# Altium schematic sheet [7] - MIO0, MIO1, SD, USB.SchDoc: MIO0, MIO1, SD CARD, USB-OTG
size B; Organization: Altium Limited; Address1: L3, 12a Rodborough Rd; Address2: Frenchs Forest; Address3: NSW; Address4: Australia 2086; DocumentNumber: 7; Revision: V1I1; SheetNumber: 7; SheetTotal: 16
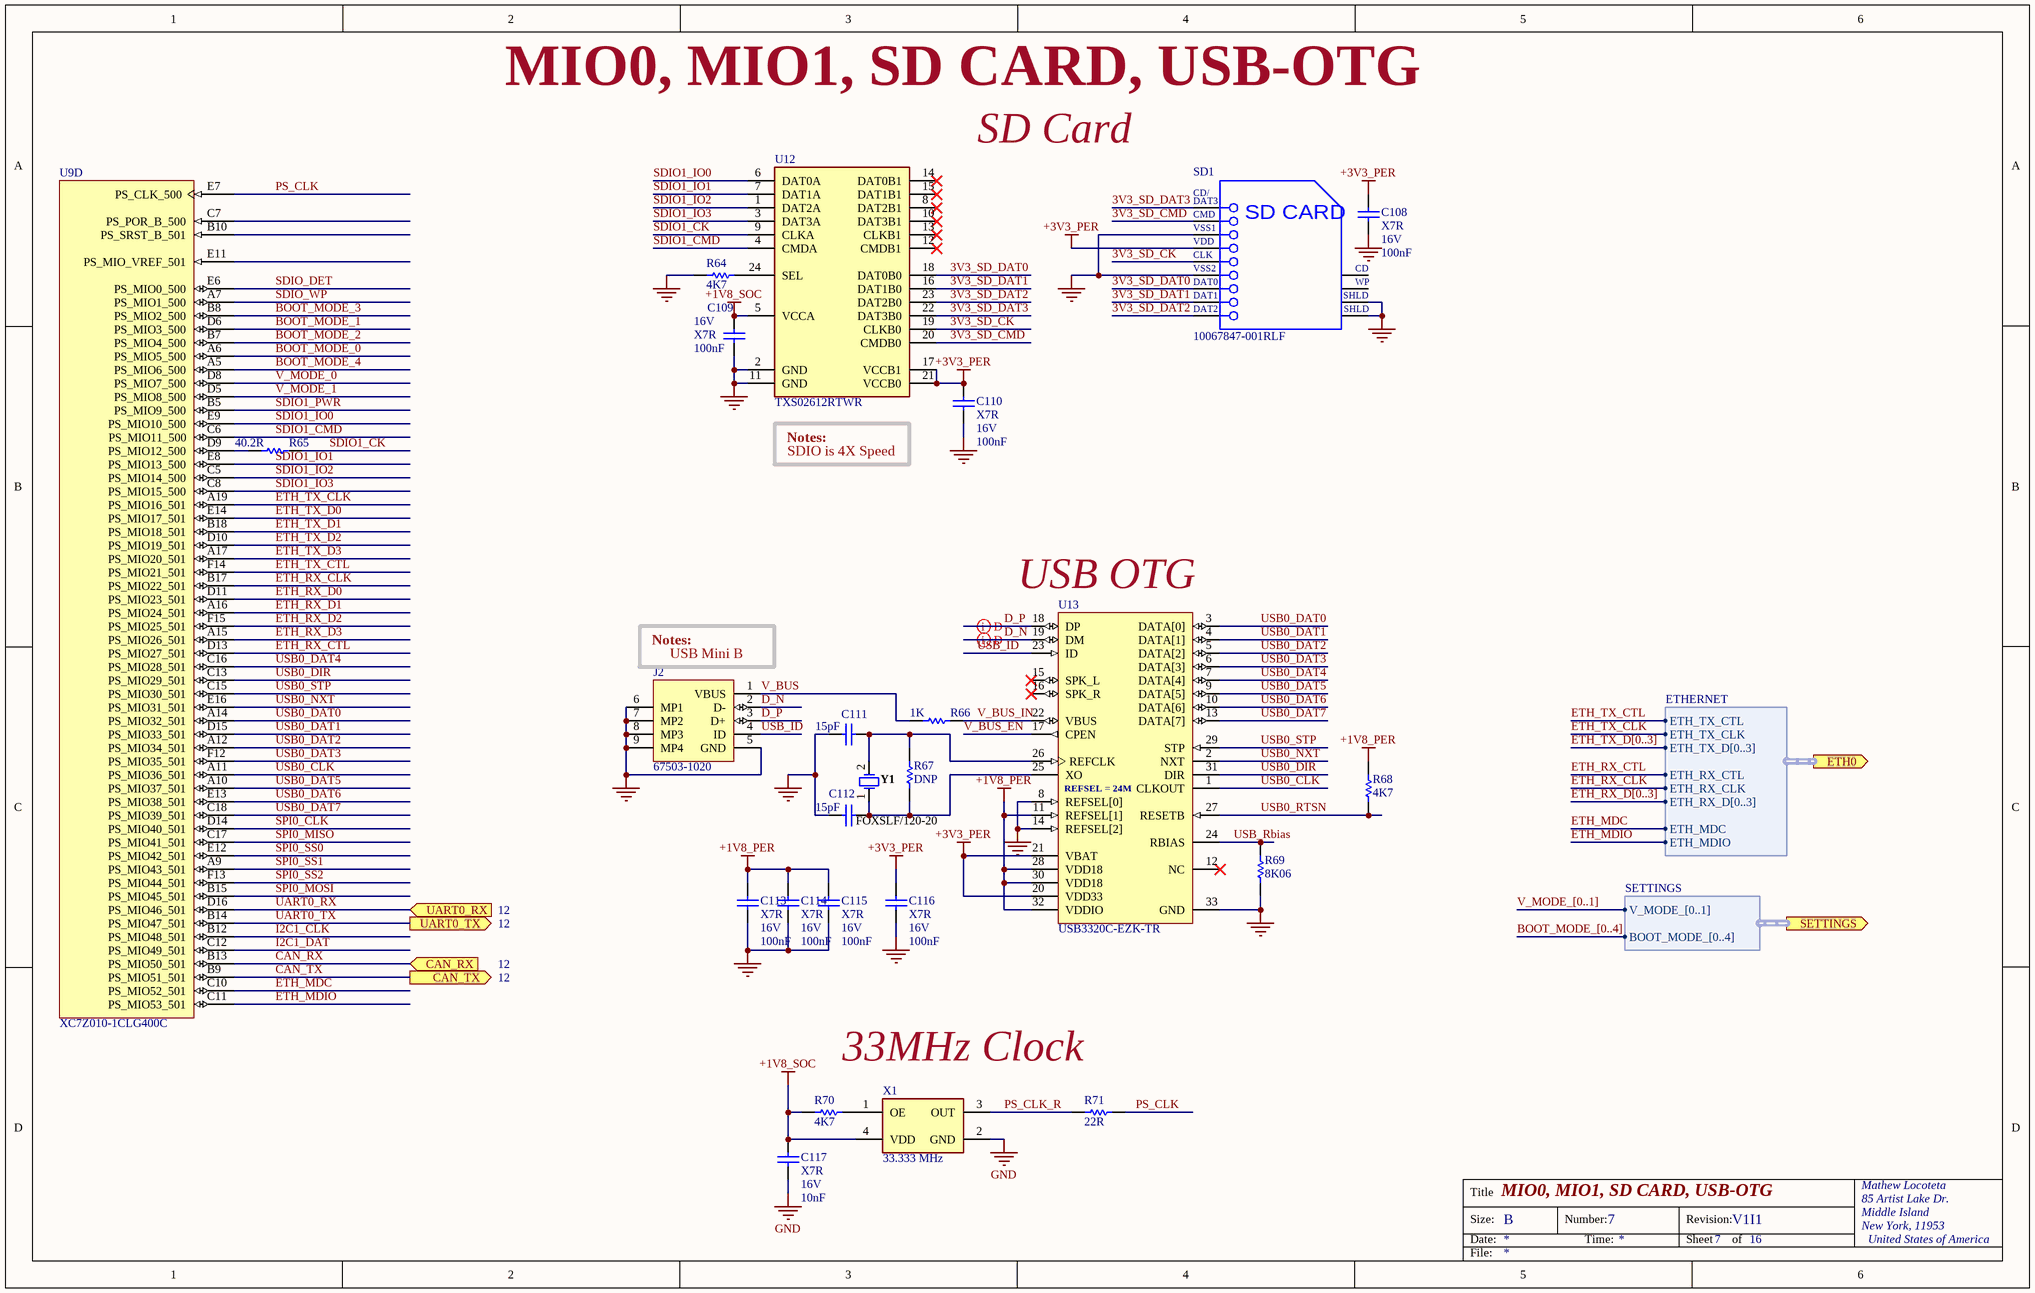
[diagram p0: [7] - MIO0, MIO1, SD, USB.SchDoc]

## Parts
C108  Dielectric: X7R  Voltage Rating: 16V  Capacitance: 100nF  (hidden comment: 100nF 0402 16V)
C109  Dielectric: X7R  Voltage Rating: 16V  Capacitance: 100nF  (hidden comment: 100nF 0402 16V)
C110  Dielectric: X7R  Voltage Rating: 16V  Capacitance: 100nF  (hidden comment: 100nF 0402 16V)
C111  Capacitance: 15pF  (hidden comment: 15 pF 50V C0G)
C112  Capacitance: 15pF  (hidden comment: 15 pF 50V C0G)
C113  Dielectric: X7R  Voltage Rating: 16V  Capacitance: 100nF  (hidden comment: 100nF 0402 16V)
C114  Dielectric: X7R  Voltage Rating: 16V  Capacitance: 100nF  (hidden comment: 100nF 0402 16V)
C115  Dielectric: X7R  Voltage Rating: 16V  Capacitance: 100nF  (hidden comment: 100nF 0402 16V)
C116  Dielectric: X7R  Voltage Rating: 16V  Capacitance: 100nF  (hidden comment: 100nF 0402 16V)
C117  Dielectric: X7R  Voltage Rating: 16V  Capacitance: 10nF  (hidden comment: 10nF 16V 0402 X7R)
J2  67503-1020  [MOLX-67503-1020_V]
R64  Resistance: 4K7  (hidden comment: 4K7 0402 1%)
R65  Resistance: 40.2R  (hidden comment: 40R2 1% 0402)
R66  Resistance: 1K  (hidden comment: 1K 1/8W 0402 1%)
R67  DNP  (no BOM)
R68  Resistance: 4K7  (hidden comment: 4K7 0402 1%)
R69  Resistance: 8K06  (hidden comment: 8K06 0402 1%)
R70  Resistance: 4K7  (hidden comment: 4K7 0402 1%)
R71  Resistance: 22R  (hidden comment: 22R 0402 1%)
SD1  10067847-001RLF  [FCI-10067847-001RLF_V]
U9  XC7Z010-1CLG400C  [CLG400]  (part D of 9)
U12  TXS02612RTWR
U13  USB3320C-EZK-TR  [MCHP-QFN-32-5x5_V2]
X1  33.333 MHz
Y1  FOXSLF/120-20  [FOX-FOXSLF-2_V]

## Ports
CAN_RX (in), CAN_TX (out), ETH0 (out, harness ETHERNET), SETTINGS (out, harness SETTINGS), UART0_RX (in), UART0_TX (out)

## Harnesses
SETTINGS: BOOT_MODE_[0..4], V_MODE_[0..1]
ETHERNET: ETH_TX_D[0..3], ETH_RX_D[0..3], ETH_RX_CLK, ETH_TX_CLK, ETH_TX_CTL, ETH_RX_CTL, ETH_MDC, ETH_MDIO

## Nets
+1V8_PER: C113.2 C114.2 C115.2 R68.2 U13.11(REFSEL[1]) U13.28(VDD18) U13.30(VDD18) U13.32(VDDIO)
+1V8_SOC: C109.2 C117.2 R70.1 U12.5(VCCA) X1.4(VDD)
+3V3_PER: C108.1 C110.1 C116.2 SD1.4(VDD) U12.17(VCCB1) U12.21(VCCB0) U13.20(VDD33) U13.21(VBAT)
GND: C108.2 C109.1 C110.2 C111.2 C112.1 C113.1 C114.1 C115.1 C116.1 C117.1 J2.5(GND) J2.6(MP1) J2.7(MP2) J2.8(MP3) J2.9(MP4) R64.1 R69.1 SD1.3(VSS1) SD1.6(VSS2) SD1.12(SHLD1) SD1.13(SHLD2) U12.2(GND) U12.11(GND) U13.8(REFSEL[0]) U13.14(REFSEL[2]) U13.33(GND) X1.2(GND)
3V3_SD_CK: SD1.5(CLK) U12.19(CLKB0)
3V3_SD_CMD: SD1.2(CMD) U12.20(CMDB0)
3V3_SD_DAT0: SD1.7(DAT0) U12.18(DAT0B0)
3V3_SD_DAT1: SD1.8(DAT1) U12.16(DAT1B0)
3V3_SD_DAT2: SD1.9(DAT2) U12.23(DAT2B0)
3V3_SD_DAT3: SD1.1(CD/DAT3) U12.22(DAT3B0)
BOOT_MODE_0: U9.A6(PS_MIO5_500)
BOOT_MODE_1: U9.D6(PS_MIO3_500)
BOOT_MODE_2: U9.B7(PS_MIO4_500)
BOOT_MODE_3: U9.B8(PS_MIO2_500)
BOOT_MODE_4: U9.A5(PS_MIO6_500)
CAN_RX: U9.B13(PS_MIO50_501) ; port CAN_RX
CAN_TX: U9.B9(PS_MIO51_501) ; port CAN_TX
D_N: J2.2(D-) U13.19(DM)
D_P: J2.3(D+) U13.18(DP)
ETH_MDC: U9.C10(PS_MIO52_501) ; port ETH0.ETH_MDC
ETH_MDIO: U9.C11(PS_MIO53_501) ; port ETH0.ETH_MDIO
ETH_RX_CLK: U9.B17(PS_MIO22_501) ; port ETH0.ETH_RX_CLK
ETH_RX_CTL: U9.D13(PS_MIO27_501) ; port ETH0.ETH_RX_CTL
ETH_RX_D0: U9.D11(PS_MIO23_501)
ETH_RX_D1: U9.A16(PS_MIO24_501)
ETH_RX_D2: U9.F15(PS_MIO25_501)
ETH_RX_D3: U9.A15(PS_MIO26_501)
ETH_TX_CLK: U9.A19(PS_MIO16_501) ; port ETH0.ETH_TX_CLK
ETH_TX_CTL: U9.F14(PS_MIO21_501) ; port ETH0.ETH_TX_CTL
ETH_TX_D0: U9.E14(PS_MIO17_501)
ETH_TX_D1: U9.B18(PS_MIO18_501)
ETH_TX_D2: U9.D10(PS_MIO19_501)
ETH_TX_D3: U9.A17(PS_MIO20_501)
I2C1_CLK: U9.B12(PS_MIO48_501)
I2C1_DAT: U9.C12(PS_MIO49_501)
PS_CLK: R71.2 U9.E7(PS_CLK_500)
PS_CLK_R: R71.1 X1.3(OUT)
SDIO1_CK: R65.2 U12.9(CLKA)
SDIO1_CMD: U9.C6(PS_MIO11_500) U12.4(CMDA)
SDIO1_IO0: U9.E9(PS_MIO10_500) U12.6(DAT0A)
SDIO1_IO1: U9.E8(PS_MIO13_500) U12.7(DAT1A)
SDIO1_IO2: U9.C5(PS_MIO14_500) U12.1(DAT2A)
SDIO1_IO3: U9.C8(PS_MIO15_500) U12.3(DAT3A)
SDIO1_PWR: U9.B5(PS_MIO9_500)
SDIO_DET: U9.E6(PS_MIO0_500)
SDIO_WP: U9.A7(PS_MIO1_500)
SPI0_CLK: U9.D14(PS_MIO40_501)
SPI0_MISO: U9.C17(PS_MIO41_501)
SPI0_MOSI: U9.B15(PS_MIO45_501)
SPI0_SS0: U9.E12(PS_MIO42_501)
SPI0_SS1: U9.A9(PS_MIO43_501)
SPI0_SS2: U9.F13(PS_MIO44_501)
UART0_RX: U9.D16(PS_MIO46_501) ; port UART0_RX
UART0_TX: U9.B14(PS_MIO47_501) ; port UART0_TX
USB0_CLK: U9.A11(PS_MIO36_501) U13.1(CLKOUT)
USB0_DAT0: U9.A14(PS_MIO32_501) U13.3(DATA[0])
USB0_DAT1: U9.D15(PS_MIO33_501) U13.4(DATA[1])
USB0_DAT2: U9.A12(PS_MIO34_501) U13.5(DATA[2])
USB0_DAT3: U9.F12(PS_MIO35_501) U13.6(DATA[3])
USB0_DAT4: U9.C16(PS_MIO28_501) U13.7(DATA[4])
USB0_DAT5: U9.A10(PS_MIO37_501) U13.9(DATA[5])
USB0_DAT6: U9.E13(PS_MIO38_501) U13.10(DATA[6])
USB0_DAT7: U9.C18(PS_MIO39_501) U13.13(DATA[7])
USB0_DIR: U9.C13(PS_MIO29_501) U13.31(DIR)
USB0_NXT: U9.E16(PS_MIO31_501) U13.2(NXT)
USB0_RTSN: R68.1 U13.27(RESETB)
USB0_STP: U9.C15(PS_MIO30_501) U13.29(STP)
USB_ID: J2.4(ID) U13.23(ID)
USB_Rbias: R69.2 U13.24(RBIAS)
V_BUS: J2.1(VBUS) R66.1
V_BUS_EN: U13.17(CPEN)
V_BUS_IN: R66.2 U13.22(VBUS)
V_MODE_0: U9.D8(PS_MIO7_500)
V_MODE_1: U9.D5(PS_MIO8_500)
NetC111_1: C111.1 R67.2 U13.26(REFCLK) Y1.2
NetC112_2: C112.2 R67.1 U13.25(XO) Y1.1
NetR64_2: R64.2 U12.24(SEL)
NetR65_1: R65.1 U9.D9(PS_MIO12_500)
NetR70_2: R70.2 X1.1(OE)

Not connected (* = marked no-connect by the designer): SD1 10(CD) 11(WP); U9 B10(PS_SRST_B_501) C7(PS_POR_B_500) E11(PS_MIO_VREF_501); U12 8(DAT2B1)* 10(DAT3B1)* 12(CMDB1)* 13(CLKB1)* 14(DAT0B1)* 15(DAT1B1)*; U13 12(NC)* 15(SPK_L)* 16(SPK_R)*

## Buses and harness runs
bus BOOT_MODE_[0..4]
bus ETH_RX_D[0..3]
bus ETH_TX_D[0..3]
bus V_MODE_[0..1]

## Layout directives
differential pair: D_N, D_P

## Notes on the sheet
- MIO0, MIO1, SD CARD, USB-OTG
- SD Card
- (near U12) Notes:
- SDIO is 4X Speed
- (near J2) Notes:
- (near U13) USB OTG
- (near J2) USB Mini B
- (near U13) REFSEL = 24M
- 12
- 33MHz Clock
- Title
- Size:
- Date:
- B
- Number:
- Time:
- Revision:
- Sheet
- of
- Mathew Locoteta
- 85 Artist Lake Dr.
- Middle Island
- New York, 11953
- United States of America
- File:
- (in symbol CMP-2000-05818-1) CD/; DAT3; SD CARD; SHLD

## Library data of the parts
C108-C110 C113-C116 = C0402C104J4RACTU: KEMET - C0402C104J4RACTU - SMD Multilayer Ceramic Capacitor, 0.1 µF, 16 V, 0402 [1005 Metric], ± 5%, X7R, C Series KEMET; Dissipation Factor: 3.5%; Supplier 1: Digi-Key; Manufacturer: KEMET; Manufacturer Part Number: C0402C104J4RACTU; RoHS: Yes; Category: Ceramic Capacitors; Stock 1: 106350; Pricing 1: 1=0.48000, 10=0.33900, 50=0.25620, 100=0.22310, 500=0.16528, 1000=0.14049, 2500=0.13223, 5000=0.12396 (USD); Mount: Surface Mount,PCB; Case/Package: 0402; Case Code (Metric): 1005; Case Code (Imperial): 0402; Dielectric Material: Ceramic; Contact Plating: Tin,Matte; Min Operating Temperature: -55°C; Max Operating Temperature: 125°C; Tolerance: 5%; Packaging: Tape and Reel; Package Quantity: 1; Termination: SMD/SMT; Voltage: 16V; Length: 1mm; Height: 0.5mm; Width: 0.02inch; Thickness: 0.022inch; Depth: 0.5mm; Radiation Hardening: No; REACH SVHC: No SVHC; ComponentLink1URL: https://datasheet.ciiva.com/5415/kem-c1002-x7r-smd-5415819.pdf?src-supplier=Mouser; ComponentLink1Description: https://datasheet.ciiva.com/5415/kem-c1002-x7r-smd-5415819.pdf?src-supplier=Mouser; ComponentLink2URL: https://datasheet.ciiva.com/46424/1851736-46424159.pdf?src-supplier=Element14; ComponentLink2Description: https://datasheet.ciiva.com/46424/1851736-46424159.pdf?src-supplier=Element14; Supplier Part Number 1: 399-7761-1-ND; Voltage Rating (DC): 16V
C111 C112 = CGA2B2C0G1H150J050BA: CAP CER 15PF 50V C0G 0402; Manufacturer: TDK; Tolerance: 5%; Supplier 1: Digi-Key; Manufacturer Part Number: CGA2B2C0G1H150J050BA; RoHS: Yes; Category: Ceramic Capacitors; Stock 1: 21961; Pricing 1: 1=0.10000, 10=0.05700, 50=0.03120, 100=0.02550, 500=0.01820, 1000=0.01429, 2500=0.01299, 5000=0.01195 (USD); Mount: Surface Mount; Case/Package: 0402; Weight: 2.3E-05oz; Case Code (Metric): 1005; Case Code (Imperial): 0402; Min Operating Temperature: -55°C; Max Operating Temperature: 125°C; Packaging: Tape and Reel; Package Quantity: 1; Voltage Rating (DC): 50V; Termination: SMD/SMT; Composition: Ceramic; Length: 1mm; Height: 0.5mm; Width: 0.02inch; Thickness: 0.022inch; Depth: 0.5mm; Ratings: AEC-Q200; Lead Free: Lead Free; REACH SVHC: No SVHC; ComponentLink1URL: https://datasheet.ciiva.com/24216/cga2b2c0g1h150j050ba-266199-24216926.pdf?src-supplier=Mouser; ComponentLink1Description: https://datasheet.ciiva.com/24216/cga2b2c0g1h150j050ba-266199-24216926.pdf?src-supplier=Mouser; Supplier Part Number 1: 445-5586-1-ND; Dielectric: C0G; Voltage Rating: 50V
C117 = C0402C103J4RACTU: KEMET - C0402C103J4RACTU - SMD Multilayer Ceramic Capacitor, 10000 pF, 16 V, 0402 [1005 Metric], ± 5%, X7R, C Series KEMET; Dissipation Factor: 3.5%; Supplier 1: Digi-Key; Manufacturer: KEMET; Manufacturer Part Number: C0402C103J4RACTU; RoHS: Yes; Category: Ceramic Capacitors; Stock 1: 814650; Pricing 1: 1=0.53000, 10=0.37100, 50=0.25960, 100=0.22250, 500=0.16688, 1000=0.14093, 2500=0.13351, 5000=0.12609 (USD); Mount: Surface Mount,PCB; Case/Package: 0402; Number of Pins: 2; Case Code (Metric): 1005; Case Code (Imperial): 0402; Dielectric Material: Ceramic; Min Operating Temperature: -55°C; Max Operating Temperature: 125°C; Packaging: Tape and Reel; Tolerance: 5%; Package Quantity: 10000; Voltage Rating (DC): 16V; Termination: SMD/SMT; Voltage: 16V; Length: 1mm; Height: 0.5mm; Width: 0.02inch; Thickness: 0.022inch; Depth: 0.5mm; Radiation Hardening: No; REACH SVHC: No SVHC; ComponentLink1URL: https://datasheet.ciiva.com/46448/1851736-46448647.pdf?src-supplier=Element14; ComponentLink1Description: https://datasheet.ciiva.com/46448/1851736-46448647.pdf?src-supplier=Element14; ComponentLink2URL: https://datasheet.ciiva.com/14593/70095383-14593069.pdf?src-supplier=Allied+Electronics; ComponentLink2Description: https://datasheet.ciiva.com/14593/70095383-14593069.pdf?src-supplier=Allied+Electronics; ComponentLink3URL: https://datasheet.ciiva.com/7747/kem-c1002-x7r-smd-7747611.pdf?src-supplier=Element14; ComponentLink3Description: https://datasheet.ciiva.com/7747/kem-c1002-x7r-smd-7747611.pdf?src-supplier=Element14; ComponentLink4URL: https://datasheet.ciiva.com/14604/70095383-14604557.pdf?src-supplier=Allied+Electronics; ComponentLink4Description: https://datasheet.ciiva.com/14604/70095383-14604557.pdf?src-supplier=Allied+Electronics; ComponentLink5URL: https://datasheet.ciiva.com/28645/1851736-28645374.pdf?src-supplier=Element14; ComponentLink5Description: https://datasheet.ciiva.com/28645/1851736-28645374.pdf?src-supplier=Element14; Supplier Part Number 1: 399-1039-1-ND
J2 = CMP-0411-00002-1: USB, MINI, SMD, RA KME04-USBMU03A01; Manufacturer: Molex; ComponentLink1URL: http://www.molex.com/; PartNumber: 67503-1020; Mounting Technology: Surface Mount; ComponentLink1Description: Manufacturer URL; Terminal Pitch: 0.8 mm; DatasheetVersion: Rev F, 06/2009; ComponentLink2Description: Datasheet; PackageDescription: Mini USB Connector, SMT, Righer Angle; ComponentLink2URL: http://www.molex.com/pdm_docs/sd/675031020_sd.pdf; PackageReference: 67503-1020
R64 R68 R70 = CRCW04024K70FKED: Resistor SMD 4.7 kOhm 0402 PU=10000 ST, CRCW04024K70FKED, Vishay; Power Rating: 63mW; Temperature Coefficient: 100ppm/°C; Voltage Rating: 50V; Supplier 1: Digi-Key; Manufacturer: Vishay; Manufacturer Part Number: CRCW04024K70FKED; RoHS: Yes; Category: Chip SMD Resistors; Stock 1: 575743; Pricing 1: 1=0.10000, 10=0.03500, 100=0.01410, 1000=0.00633, 2500=0.00550, 5000=0.00454 (USD); Mount: Surface Mount; Case/Package: 0402; Weight: 2.3E-05oz; Contact Plating: Tin; Case Code (Imperial): 0402; Case Code (Metric): 1005; Min Operating Temperature: -55°C; Max Operating Temperature: 155°C; Tolerance: 1%; Composition: Thick Film; Packaging: Tape and Reel; Package Quantity: 10; Termination: SMD/SMT; Military Standard: Not; Voltage Rating (DC): 50V; Number of Terminations: 2; Max Power Dissipation: 63mW; Features: Automotive AEC-Q200; Length: 1mm; Height: 0.35mm; Width: 0.5mm; Depth: 0.5mm; Radiation Hardening: No; Lead Free: Lead Free; REACH SVHC: Unknown; ComponentLink1URL: https://datasheet.ciiva.com/11808/0900766b80d98824-11808622.pdf?src-supplier=RSComponents; ComponentLink1Description: https://datasheet.ciiva.com/11808/0900766b80d98824-11808622.pdf?src-supplier=RSComponents; ComponentLink2URL: https://datasheet.ciiva.com/3256/dcrcwe3-3256597.pdf?src-supplier=Avnet; ComponentLink2Description: https://datasheet.ciiva.com/3256/dcrcwe3-3256597.pdf?src-supplier=Avnet; ComponentLink3URL: https://datasheet.ciiva.com/5550/dcrcwe3-109170-5550295.pdf?src-supplier=Mouser; ComponentLink3Description: https://datasheet.ciiva.com/5550/dcrcwe3-109170-5550295.pdf?src-supplier=Mouser; ComponentLink4URL: https://datasheet.ciiva.com/16764/70201119-16764281.pdf?src-supplier=Allied+Electronics; ComponentLink4Description: https://datasheet.ciiva.com/16764/70201119-16764281.pdf?src-supplier=Allied+Electronics; ComponentLink5URL: https://datasheet.ciiva.com/2463/dcrcwe3-2463034.pdf?src-supplier=Digi-Key; ComponentLink5Description: https://datasheet.ciiva.com/2463/dcrcwe3-2463034.pdf?src-supplier=Digi-Key; ComponentLink6URL: https://datasheet.ciiva.com/16881/dcrcwe3-16881690.pdf?src-supplier=Avnet+Europe; ComponentLink6Description: https://datasheet.ciiva.com/16881/dcrcwe3-16881690.pdf?src-supplier=Avnet+Europe; ComponentLink7URL: https://datasheet.ciiva.com/2463/dcrcwe3-2463035.pdf?src-supplier=Digi-Key; ComponentLink7Description: https://datasheet.ciiva.com/2463/dcrcwe3-2463035.pdf?src-supplier=Digi-Key; ComponentLink8URL: https://datasheet.ciiva.com/8079/1697337-8079643.pdf?src-supplier=Element14; ComponentLink8Description: https://datasheet.ciiva.com/8079/1697337-8079643.pdf?src-supplier=Element14; ComponentLink9URL: https://datasheet.ciiva.com/2463/dcrcwe3-2463036.pdf?src-supplier=Digi-Key; ComponentLink9Description: https://datasheet.ciiva.com/2463/dcrcwe3-2463036.pdf?src-supplier=Digi-Key; ComponentLink10URL: https://datasheet.ciiva.com/26316/fld-crcw-e3-data-en-26316654.pdf?src-supplier=Distrelec; ComponentLink10Description: https://datasheet.ciiva.com/26316/fld-crcw-e3-data-en-26316654.pdf?src-supplier=Distrelec; Supplier Part Number 1: 541-4.70KLCT-ND
R65 = CRCW040240R2FKED: RES SMD 40.2 OHM 1% 1/16W 0402; Manufacturer: Vishay; Temperature Coefficient: 100ppm/°C; Power Rating: 63mW; Voltage Rating: 50V; Supplier 1: Digi-Key; Manufacturer Part Number: CRCW040240R2FKED; RoHS: Yes; Category: Chip SMD Resistors; Stock 1: 50000; Pricing 1: 1=0.10000, 10=0.03500, 100=0.01410, 1000=0.00633, 2500=0.00550, 5000=0.00454 (USD); Mount: Surface Mount; Number of Pins: 2; Weight: 2.3E-05oz; Contact Plating: Tin; Case Code (Metric): 1005; Case Code (Imperial): 0402; Min Operating Temperature: -55°C; Max Operating Temperature: 155°C; Tolerance: 1%; Composition: Thick Film; Packaging: Tape and Reel; Termination: SMD/SMT; Package Quantity: 10; Number of Terminations: 2; Max Power Dissipation: 63mW; Features: Automotive AEC-Q200; Military Standard: Not; Voltage Rating (DC): 50V; Length: 1mm; Height: 0.35mm; Width: 0.02inch; Depth: 0.5mm; Radiation Hardening: No; Lead Free: Lead Free; REACH SVHC: Unknown; ComponentLink1URL: https://datasheet.ciiva.com/11818/0900766b80d98824-11818096.pdf?src-supplier=RSComponents; ComponentLink1Description: https://datasheet.ciiva.com/11818/0900766b80d98824-11818096.pdf?src-supplier=RSComponents; ComponentLink2URL: https://datasheet.ciiva.com/2463/dcrcwe3-2463936.pdf?src-supplier=Digi-Key; ComponentLink2Description: https://datasheet.ciiva.com/2463/dcrcwe3-2463936.pdf?src-supplier=Digi-Key; ComponentLink3URL: https://datasheet.ciiva.com/7732/1697337-7732005.pdf?src-supplier=Element14; ComponentLink3Description: https://datasheet.ciiva.com/7732/1697337-7732005.pdf?src-supplier=Element14; ComponentLink4URL: https://datasheet.ciiva.com/16882/dcrcwe3-16882343.pdf?src-supplier=Avnet+Europe; ComponentLink4Description: https://datasheet.ciiva.com/16882/dcrcwe3-16882343.pdf?src-supplier=Avnet+Europe; ComponentLink5URL: https://datasheet.ciiva.com/16784/70201119-16784936.pdf?src-supplier=Allied+Electronics; ComponentLink5Description: https://datasheet.ciiva.com/16784/70201119-16784936.pdf?src-supplier=Allied+Electronics; ComponentLink6URL: https://datasheet.ciiva.com/3256/dcrcwe3-3256507.pdf?src-supplier=Avnet; ComponentLink6Description: https://datasheet.ciiva.com/3256/dcrcwe3-3256507.pdf?src-supplier=Avnet; ComponentLink7URL: https://datasheet.ciiva.com/22872/70201119-22872251.pdf?src-supplier=Allied+Electronics; ComponentLink7Description: https://datasheet.ciiva.com/22872/70201119-22872251.pdf?src-supplier=Allied+Electronics; ComponentLink8URL: https://datasheet.ciiva.com/2463/dcrcwe3-2463934.pdf?src-supplier=Digi-Key; ComponentLink8Description: https://datasheet.ciiva.com/2463/dcrcwe3-2463934.pdf?src-supplier=Digi-Key; ComponentLink9URL: https://datasheet.ciiva.com/2463/dcrcwe3-2463935.pdf?src-supplier=Digi-Key; ComponentLink9Description: https://datasheet.ciiva.com/2463/dcrcwe3-2463935.pdf?src-supplier=Digi-Key; Supplier Part Number 1: 541-40.2LDKR-ND; Case/Package: 0402
R66 = CRCW04021K00FKEDHP: Res Thick Film 0402 1K Ohm 1% 1/8W 100ppm/C Molded SMD SMD Paper T/R; Manufacturer: Vishay Dale; Temperature Coefficient: 100ppm/°C; Max Power Dissipation: 125mW; Voltage Rating: 50V; Supplier 1: Digi-Key; Manufacturer Part Number: CRCW04021K00FKEDHP; RoHS: Yes; Category: Chip SMD Resistors; Stock 1: 274823; Pricing 1: 1=0.14000, 10=0.12100, 100=0.04670, 1000=0.02053, 2500=0.01773, 5000=0.01586 (USD); Mount: Surface Mount; Case/Package: 0402; Number of Pins: 2; Weight: 2.3E-05oz; Contact Plating: Tin; Case Code (Imperial): 0402; Case Code (Metric): 1005; Min Operating Temperature: -55°C; Max Operating Temperature: 155°C; Tolerance: 1%; Composition: Thick Film; Packaging: Tape and Reel; Package Quantity: 10; Number of Terminations: 2; Features: Automotive AEC-Q200; Power Rating: 125mW; Termination: SMD/SMT; Military Standard: Not; Voltage Rating (DC): 50V; Length: 1mm; Height: 0.3mm; Width: 0.5mm; Depth: 0.5mm; Radiation Hardening: No; Lead Free: Lead Free; REACH SVHC: Unknown; ComponentLink1URL: https://datasheet.ciiva.com/5545/crcwhpe3-46056-5545653.pdf?src-supplier=Mouser; ComponentLink1Description: https://datasheet.ciiva.com/5545/crcwhpe3-46056-5545653.pdf?src-supplier=Mouser; ComponentLink2URL: https://datasheet.ciiva.com/2498/crcwhpe3-2498728.pdf?src-supplier=Digi-Key; ComponentLink2Description: https://datasheet.ciiva.com/2498/crcwhpe3-2498728.pdf?src-supplier=Digi-Key; ComponentLink3URL: https://datasheet.ciiva.com/16436/crcwhpe3-16436184.pdf?src-supplier=Future+Electronics; ComponentLink3Description: https://datasheet.ciiva.com/16436/crcwhpe3-16436184.pdf?src-supplier=Future+Electronics; ComponentLink4URL: https://datasheet.ciiva.com/2498/crcwhpe3-2498729.pdf?src-supplier=Digi-Key; ComponentLink4Description: https://datasheet.ciiva.com/2498/crcwhpe3-2498729.pdf?src-supplier=Digi-Key; ComponentLink5URL: https://datasheet.ciiva.com/2498/crcwhpe3-2498730.pdf?src-supplier=Digi-Key; ComponentLink5Description: https://datasheet.ciiva.com/2498/crcwhpe3-2498730.pdf?src-supplier=Digi-Key; ComponentLink6URL: https://datasheet.ciiva.com/28621/1750852-28621339.pdf?src-supplier=Element14; ComponentLink6Description: https://datasheet.ciiva.com/28621/1750852-28621339.pdf?src-supplier=Element14; ComponentLink7URL: https://datasheet.ciiva.com/3256/crcwhpe3-3256142.pdf?src-supplier=Avnet; ComponentLink7Description: https://datasheet.ciiva.com/3256/crcwhpe3-3256142.pdf?src-supplier=Avnet; Supplier Part Number 1: 541-1.00KYCT-ND
R67 = CRCW04024K70FKED: Manufacturer: Vishay; Tolerance: 1%; Power Rating: 63mW; Temperature Coefficient: 100ppm/°C; Voltage Rating: 50V; Supplier 1: Digi-Key; Manufacturer Part Number: CRCW04024K70FKED; RoHS: Yes; Category: Chip SMD Resistors; Stock 1: 575743; Pricing 1: 1=0.10000, 10=0.03500, 100=0.01410, 1000=0.00633, 2500=0.00550, 5000=0.00454 (USD); Mount: Surface Mount; Case/Package: 0402; Weight: 2.3E-05oz; Contact Plating: Tin; Case Code (Imperial): 0402; Case Code (Metric): 1005; Min Operating Temperature: -55°C; Max Operating Temperature: 155°C; Composition: Thick Film; Packaging: Tape and Reel; Package Quantity: 10; Termination: SMD/SMT; Military Standard: Not; Voltage Rating (DC): 50V; Number of Terminations: 2; Max Power Dissipation: 63mW; Features: Automotive AEC-Q200; Length: 1mm; Height: 0.35mm; Width: 0.5mm; Depth: 0.5mm; Radiation Hardening: No; Lead Free: Lead Free; REACH SVHC: Unknown; ComponentLink1URL: https://datasheet.ciiva.com/11808/0900766b80d98824-11808622.pdf?src-supplier=RSComponents; ComponentLink1Description: https://datasheet.ciiva.com/11808/0900766b80d98824-11808622.pdf?src-supplier=RSComponents; ComponentLink2URL: https://datasheet.ciiva.com/3256/dcrcwe3-3256597.pdf?src-supplier=Avnet; ComponentLink2Description: https://datasheet.ciiva.com/3256/dcrcwe3-3256597.pdf?src-supplier=Avnet; ComponentLink3URL: https://datasheet.ciiva.com/5550/dcrcwe3-109170-5550295.pdf?src-supplier=Mouser; ComponentLink3Description: https://datasheet.ciiva.com/5550/dcrcwe3-109170-5550295.pdf?src-supplier=Mouser; ComponentLink4URL: https://datasheet.ciiva.com/16764/70201119-16764281.pdf?src-supplier=Allied+Electronics; ComponentLink4Description: https://datasheet.ciiva.com/16764/70201119-16764281.pdf?src-supplier=Allied+Electronics; ComponentLink5URL: https://datasheet.ciiva.com/2463/dcrcwe3-2463034.pdf?src-supplier=Digi-Key; ComponentLink5Description: https://datasheet.ciiva.com/2463/dcrcwe3-2463034.pdf?src-supplier=Digi-Key; ComponentLink6URL: https://datasheet.ciiva.com/16881/dcrcwe3-16881690.pdf?src-supplier=Avnet+Europe; ComponentLink6Description: https://datasheet.ciiva.com/16881/dcrcwe3-16881690.pdf?src-supplier=Avnet+Europe; ComponentLink7URL: https://datasheet.ciiva.com/2463/dcrcwe3-2463035.pdf?src-supplier=Digi-Key; ComponentLink7Description: https://datasheet.ciiva.com/2463/dcrcwe3-2463035.pdf?src-supplier=Digi-Key; ComponentLink8URL: https://datasheet.ciiva.com/8079/1697337-8079643.pdf?src-supplier=Element14; ComponentLink8Description: https://datasheet.ciiva.com/8079/1697337-8079643.pdf?src-supplier=Element14; ComponentLink9URL: https://datasheet.ciiva.com/2463/dcrcwe3-2463036.pdf?src-supplier=Digi-Key; ComponentLink9Description: https://datasheet.ciiva.com/2463/dcrcwe3-2463036.pdf?src-supplier=Digi-Key; ComponentLink10URL: https://datasheet.ciiva.com/26316/fld-crcw-e3-data-en-26316654.pdf?src-supplier=Distrelec; ComponentLink10Description: https://datasheet.ciiva.com/26316/fld-crcw-e3-data-en-26316654.pdf?src-supplier=Distrelec; Supplier Part Number 1: 541-4.70KLCT-ND; Resistance: DNP
R69 = CRCW04028K06FKED: Res Thick Film 0402 8.06K Ohm 1% 0.063W(1/16W) ±100ppm/C Molded SMD Automotive Paper T/R; Manufacturer: Vishay; Temperature Coefficient: 100ppm/°C; Power Rating: 63mW; Voltage Rating: 50V; Supplier 1: Digi-Key; Manufacturer Part Number: CRCW04028K06FKED; RoHS: Yes; Category: Chip SMD Resistors; Stock 1: 12116; Pricing 1: 1=0.10000, 10=0.03500, 100=0.01410, 1000=0.00633, 2500=0.00550, 5000=0.00454 (USD); Mount: Surface Mount; Case/Package: 0402; Number of Pins: 2; Weight: 2.3E-05oz; Contact Plating: Tin; Case Code (Imperial): 0402; Case Code (Metric): 1005; Min Operating Temperature: -55°C; Max Operating Temperature: 155°C; Tolerance: 1%; Composition: Thick Film; Packaging: Tape and Reel; Package Quantity: 10; Number of Terminations: 2; Termination: SMD/SMT; Max Power Dissipation: 63mW; Features: Automotive AEC-Q200; Military Standard: Not; Voltage Rating (DC): 50V; Length: 1mm; Height: 0.35mm; Width: 0.5mm; Depth: 0.5mm; Radiation Hardening: No; Lead Free: Lead Free; REACH SVHC: Unknown; ComponentLink1URL: https://datasheet.ciiva.com/11818/0900766b80d98824-11818119.pdf?src-supplier=RSComponents; ComponentLink1Description: https://datasheet.ciiva.com/11818/0900766b80d98824-11818119.pdf?src-supplier=RSComponents; ComponentLink2URL: https://datasheet.ciiva.com/5542/dcrcwe3-109170-5542949.pdf?src-supplier=Mouser; ComponentLink2Description: https://datasheet.ciiva.com/5542/dcrcwe3-109170-5542949.pdf?src-supplier=Mouser; ComponentLink3URL: https://datasheet.ciiva.com/16767/70201119-16767653.pdf?src-supplier=Allied+Electronics; ComponentLink3Description: https://datasheet.ciiva.com/16767/70201119-16767653.pdf?src-supplier=Allied+Electronics; ComponentLink4URL: https://datasheet.ciiva.com/7690/1533075-7690854.pdf?src-supplier=Element14; ComponentLink4Description: https://datasheet.ciiva.com/7690/1533075-7690854.pdf?src-supplier=Element14; ComponentLink5URL: https://datasheet.ciiva.com/16885/dcrcwe3-16885846.pdf?src-supplier=Avnet+Europe; ComponentLink5Description: https://datasheet.ciiva.com/16885/dcrcwe3-16885846.pdf?src-supplier=Avnet+Europe; ComponentLink6URL: https://datasheet.ciiva.com/2463/dcrcwe3-2463529.pdf?src-supplier=Digi-Key; ComponentLink6Description: https://datasheet.ciiva.com/2463/dcrcwe3-2463529.pdf?src-supplier=Digi-Key; ComponentLink7URL: https://datasheet.ciiva.com/2463/dcrcwe3-2463530.pdf?src-supplier=Digi-Key; ComponentLink7Description: https://datasheet.ciiva.com/2463/dcrcwe3-2463530.pdf?src-supplier=Digi-Key; ComponentLink8URL: https://datasheet.ciiva.com/2463/dcrcwe3-2463531.pdf?src-supplier=Digi-Key; ComponentLink8Description: https://datasheet.ciiva.com/2463/dcrcwe3-2463531.pdf?src-supplier=Digi-Key; ComponentLink9URL: https://datasheet.ciiva.com/7690/1697337-7690701.pdf?src-supplier=Element14; ComponentLink9Description: https://datasheet.ciiva.com/7690/1697337-7690701.pdf?src-supplier=Element14; Supplier Part Number 1: 541-8.06KLCT-ND
R71 = CRCW040222R0FKED: VISHAY - CRCW040222R0FKED. - Resistor Case Style:0402 [1005 Metric]; Temperature Coefficient: 100ppm/°C; Power Rating: 63mW; Voltage Rating: 50V; Supplier 1: Newark; Manufacturer: Vishay; Manufacturer Part Number: CRCW040222R0FKED; RoHS: Yes; Category: Chip SMD Resistors; Stock 1: 410000; Pricing 1: 1=0.00800, 5000=0.00800, 10000=0.00600 (USD); Mount: Surface Mount; Case/Package: 0402; Weight: 2.3E-05oz; Contact Plating: Tin; Case Code (Metric): 1005; Case Code (Imperial): 0402; Min Operating Temperature: -55°C; Max Operating Temperature: 155°C; Tolerance: 1%; Composition: Thick Film; Packaging: Tape and Reel; Package Quantity: 10; Number of Terminations: 2; Termination: SMD/SMT; Military Standard: Not; Max Power Dissipation: 63mW; Voltage Rating (DC): 50V; Features: Automotive AEC-Q200; Length: 1mm; Height: 0.35mm; Width: 0.02inch; Depth: 0.5mm; Radiation Hardening: No; Lead Free: Lead Free; REACH SVHC: Unknown; ComponentLink1URL: https://datasheet.ciiva.com/11809/0900766b80d98824-11809869.pdf?src-supplier=RSComponents; ComponentLink1Description: https://datasheet.ciiva.com/11809/0900766b80d98824-11809869.pdf?src-supplier=RSComponents; ComponentLink2URL: https://datasheet.ciiva.com/3256/dcrcwe3-3256249.pdf?src-supplier=Avnet; ComponentLink2Description: https://datasheet.ciiva.com/3256/dcrcwe3-3256249.pdf?src-supplier=Avnet; ComponentLink3URL: https://datasheet.ciiva.com/5552/dcrcwe3-109170-5552201.pdf?src-supplier=Mouser; ComponentLink3Description: https://datasheet.ciiva.com/5552/dcrcwe3-109170-5552201.pdf?src-supplier=Mouser; ComponentLink4URL: https://datasheet.ciiva.com/3256/dcrcwe3-3256250.pdf?src-supplier=Avnet; ComponentLink4Description: https://datasheet.ciiva.com/3256/dcrcwe3-3256250.pdf?src-supplier=Avnet; ComponentLink5URL: https://datasheet.ciiva.com/16776/70201119-16776426.pdf?src-supplier=Allied+Electronics; ComponentLink5Description: https://datasheet.ciiva.com/16776/70201119-16776426.pdf?src-supplier=Allied+Electronics; ComponentLink6URL: https://datasheet.ciiva.com/26316/fld-crcw-e3-data-en-26316666.pdf?src-supplier=Distrelec; ComponentLink6Description: https://datasheet.ciiva.com/26316/fld-crcw-e3-data-en-26316666.pdf?src-supplier=Distrelec; ComponentLink7URL: https://datasheet.ciiva.com/16886/dcrcwe3-16886668.pdf?src-supplier=Avnet+Europe; ComponentLink7Description: https://datasheet.ciiva.com/16886/dcrcwe3-16886668.pdf?src-supplier=Avnet+Europe; ComponentLink8URL: https://datasheet.ciiva.com/7672/1697337-7672781.pdf?src-supplier=Element14; ComponentLink8Description: https://datasheet.ciiva.com/7672/1697337-7672781.pdf?src-supplier=Element14; ComponentLink9URL: https://datasheet.ciiva.com/7672/1697337-7672782.pdf?src-supplier=Element14; ComponentLink9Description: https://datasheet.ciiva.com/7672/1697337-7672782.pdf?src-supplier=Element14; ComponentLink10URL: https://datasheet.ciiva.com/2463/dcrcwe3-2463091.pdf?src-supplier=Digi-Key; ComponentLink10Description: https://datasheet.ciiva.com/2463/dcrcwe3-2463091.pdf?src-supplier=Digi-Key; ComponentLink11URL: https://datasheet.ciiva.com/2463/dcrcwe3-2463092.pdf?src-supplier=Digi-Key; ComponentLink11Description: https://datasheet.ciiva.com/2463/dcrcwe3-2463092.pdf?src-supplier=Digi-Key; ComponentLink12URL: https://datasheet.ciiva.com/2463/dcrcwe3-2463093.pdf?src-supplier=Digi-Key; ComponentLink12Description: https://datasheet.ciiva.com/2463/dcrcwe3-2463093.pdf?src-supplier=Digi-Key; ComponentLink13URL: https://datasheet.ciiva.com/16396/dcrcwe3-16396918.pdf?src-supplier=Future+Electronics; ComponentLink13Description: https://datasheet.ciiva.com/16396/dcrcwe3-16396918.pdf?src-supplier=Future+Electronics; Supplier Part Number 1: 24W2102
SD1 = CMP-2000-05818-1: Assembly SD Card Reader, Famale, 11 Way, -40 to 105 degC, RoHS, Tape and Reel; Manufacturer: FCI Electronics; SVHC: NoSVHC(15-Jun-2015); Connector Type: MemoryCard; No. of Contacts: 11Contacts; Datasheet Version: Rev. K, 09/2014; Datasheet URL: https://datasheet.ciiva.com/1106/10067847-1106690.pdf; Package Reference: 10067847-001RLF; Product Range: -; Contact Material: CopperAlloy; Contact Plating: GoldPlatedContacts; Package Description: 11-Pin Surface Mount Device, Body 29 x 28.5 mm; Mounting Technology: SurfaceMount; Manufacturer URL: http://portal.fciconnect.com/
U9 = CMP-0363-00007-3: 667 MHz Zynq™-7000 AP SoC, 130 PS I/O, 100 FPGA I/O, 400-Ball BGA, Speed Grade 1, Commercial Grade, Pb-Free; Flip Flops: 35200; Speed Grade: -1; LUTs: 17600; Extensible Block RAM (# 36Kb Blocks): 240 KB (60); ComponentLink6Description: PCB and Layout Guide; ComponentLink3Description: DC and AC Switching Characteristics; ComponentLink2URL: http://www.xilinx.com/support/documentation/user_guides/ug865-Zynq-7000-Pkg-Pinout.pdf; PackageReference: CLG400; ComponentLink3URL: http://www.xilinx.com/support/documentation/data_sheets/ds187-XC7Z010-XC7Z020-Data-Sheet.pdf; DatasheetVersion: v1.2; Generic Part Number: XC7Z010; ComponentLink2Description: Package Specification; ComponentLink1Description: Datasheet; PartNumber: XC7Z010-1CLG400C; ComponentLink5Description: Packaging and Pinout; Code_JEDEC: MO-275-MMAA-1; RoHS: Pb-Free; ComponentLink5URL: http://www.xilinx.com/support/documentation/user_guides/ug865-Zynq-7000-Pkg-Pinout.pdf; ComponentLink1URL: http://www.xilinx.com/support/documentation/data_sheets/ds190-Zynq-7000-Overview.pdf; ComponentLink4Description: Package File; ComponentLink4URL: http://www.xilinx.com/support/packagefiles/z7packages/xc7z010clg400pkg.txt; PackageDescription: Wire-Bond Chip-Scale BGA, Body 17 x 17 mm, 0.8 mm Pitch; PackageVersion: Rev 1.1, 09/2012; Mounting Technology: Surface Mount; ComponentLink6URL: http://www.xilinx.com/support/documentation/user_guides/ug483_7Series_PCB.pdf
U12 = TXS02612RTWR: TEXAS INSTRUMENTS - TXS02612RTWR - SDIO EXPANDER W/VOLT TRANSLATOR, WQFN-24; Number of Outputs: 12; Number of Bits: 4; Min Supply Voltage: 1.1V; Max Supply Voltage: 3.6V; Operating Supply Current: 36uA; Frequency: 60MHz; Supplier 1: Digi-Key; Manufacturer: Texas Instruments; Manufacturer Part Number: TXS02612RTWR; RoHS: Yes; Category: Interface ICs; Stock 1: 12167; Pricing 1: 1=1.37000, 10=1.22100, 25=1.15920, 100=0.89010, 250=0.78660, 500=0.74520, 1000=0.57960 (USD); Mount: Surface Mount; Number of Pins: 24; Contact Plating: Gold; Min Operating Temperature: -40°C; Max Operating Temperature: 85°C; Packaging: Tape and Reel; Package Quantity: 1; Interface: SDIO; Length: 4.15mm; Height: 0.75mm; Width: 4.15mm; Radiation Hardening: No; Lead Free: Lead Free; REACH SVHC: No SVHC; ComponentLink1URL: https://datasheet.ciiva.com/1784/txs02612-1784272.pdf?src-supplier=Digi-Key; ComponentLink1Description: https://datasheet.ciiva.com/1784/txs02612-1784272.pdf?src-supplier=Digi-Key; ComponentLink2URL: https://datasheet.ciiva.com/22652/1723912-22652098.pdf?src-supplier=Element14; ComponentLink2Description: https://datasheet.ciiva.com/22652/1723912-22652098.pdf?src-supplier=Element14; ComponentLink3URL: https://datasheet.ciiva.com/15134/getdatasheetpartid-225882-15134505.pdf?src-supplier=Verical; ComponentLink3Description: https://datasheet.ciiva.com/15134/getdatasheetpartid-225882-15134505.pdf?src-supplier=Verical; ComponentLink4URL: https://datasheet.ciiva.com/14194/txs02612-14194898.pdf?src-supplier=Avnet; ComponentLink4Description: https://datasheet.ciiva.com/14194/txs02612-14194898.pdf?src-supplier=Avnet; ComponentLink5URL: https://datasheet.ciiva.com/41460/001188030-da-01-en-ic-sdio-port-ex-txs02612rtwr-wqfn-24-tid-41460267.pdf?src-supplier=Conrad; ComponentLink5Description: https://datasheet.ciiva.com/41460/001188030-da-01-en-ic-sdio-port-ex-txs02612rtwr-wqfn-24-tid-41460267.pdf?src-supplier=Conrad; Supplier Part Number 1: 296-23869-1-ND
U13 = CMP-0186-00336-1: Highly Integrated Full Featured Hi-Speed USB 2.0 ULPI Transceiver, 1.8 to 3.3 V, -40 to 85 degC, 32-Pin QFN (QFN-3304), RoHS, Tape and Reel; Manufacturer: Microchip; REFCLK Frequency@ULPI Input Clock Mode: 60 MHz; VVBAT: 3.1 to 5.5 V; Cpin: 4 pF Max.; VDD33: 3 to 3.6 V; PartNumber: USB3320C-EZK-TR; ComponentLink1Description: Manufacturer URL; PackageVersion: Rev. H; Mounting Technology: Surface Mount; DatasheetVersion: DS00001792A; RoHS: TRUE; PackageDescription: 32-Pin Quad Flat Non-Leaded Package, Body 5 x 5 mm, Pitch 0.5 mm; ComponentLink1URL: www.microchip.com/; ComponentLink2URL: http://ww1.microchip.com/downloads/en/DeviceDoc/00001792A.pdf; Temperature Range: -40 to 85 degC; ComponentLink3Description: Package Specification; ComponentLink2Description: Datasheet; ComponentLink3URL: http://ww1.microchip.com/downloads/en/DeviceDoc/00001792A.pdf; Packing: Tape and Reel; I/O Voltage: 1.8 to 3.3 V
X1 = ASVMB-33.333MHZ-LY-T: OSC MEMS 33.333MHZ CMOS SMD; Manufacturer: Abracon; Frequency Stability: 10ppm; Load Capacitance: 15pF; Operating Supply Voltage: 3.3V; Max Supply Current: 16mA; Supplier 1: Digi-Key; Manufacturer Part Number: ASVMB-33.333MHZ-LY-T; RoHS: Yes; Category: Oscillators; Stock 1: 756; Pricing 1: 1=2.96000, 10=2.88800, 50=2.75000, 100=2.40630, 500=2.33750 (USD); Mount: Surface Mount; Case/Package: SMD/SMT; Number of Pins: 4; Min Operating Temperature: -40°C; Max Operating Temperature: 85°C; Frequency: 33.333MHz; Packaging: Tape and Reel; Termination: SMD/SMT; Length: 0.276inch; Height: 0.035inch; Width: 0.197inch; Radiation Hardening: No; ComponentLink1URL: https://datasheet.ciiva.com/869/asvmb-869921.pdf?src-supplier=Digi-Key; ComponentLink1Description: https://datasheet.ciiva.com/869/asvmb-869921.pdf?src-supplier=Digi-Key; ComponentLink2URL: https://datasheet.ciiva.com/869/asvmb-869922.pdf?src-supplier=Digi-Key; ComponentLink2Description: https://datasheet.ciiva.com/869/asvmb-869922.pdf?src-supplier=Digi-Key; ComponentLink3URL: https://datasheet.ciiva.com/869/asvmb-869923.pdf?src-supplier=Digi-Key; ComponentLink3Description: https://datasheet.ciiva.com/869/asvmb-869923.pdf?src-supplier=Digi-Key; ComponentLink4URL: https://datasheet.ciiva.com/3178/asvmb-3178123.pdf?src-supplier=Avnet; ComponentLink4Description: https://datasheet.ciiva.com/3178/asvmb-3178123.pdf?src-supplier=Avnet; Supplier Part Number 1: 535-11208-1-ND
Y1 = CMP-1749-00004-1: Resistance Weld Thru-Hole Crystal, 12 MHz, +/-30 ppm, -20 to 70 degC, 2-Pin THD, RoHS, Bulk; Elements: 1; Rds On Max: 115 mohm; Typical Rise Time: 90 ns; Max Power Dissipation: 2.5 W; Case\Package: TO-251-3; Input Capacitance: 350 pF; REACH SVHC: No SVHC; Length: 6.6 mm; ComponentLink1URL: http://www.foxonline.com/; PackageDescription: 2-Pin Through Hole Device, Body 11.35 x 4.65 mm, Pitch 4.88 mm; Radiation Hardening: No; Package Quantity: 70; Packaging: Rail/Tube; ComponentLink1Description: Manufacturer URL; Min Operating Temperature: -55 degC; Max Operating Temperature: 150 degC; RoHSCompliant: true; PackageReference: FOXSLF-2; DatasheetVersion: Mar-15; Pins: 3; Height: 6.1 mm; Mount: Through Hole; ComponentLink2URL: http://www.foxonline.com/pdfs/hc49slf.pdf; ComponentLink2Description: Datasheet; Width: 2.3 mm